# EAGLE design shift_reg (EAGLE 5.11)
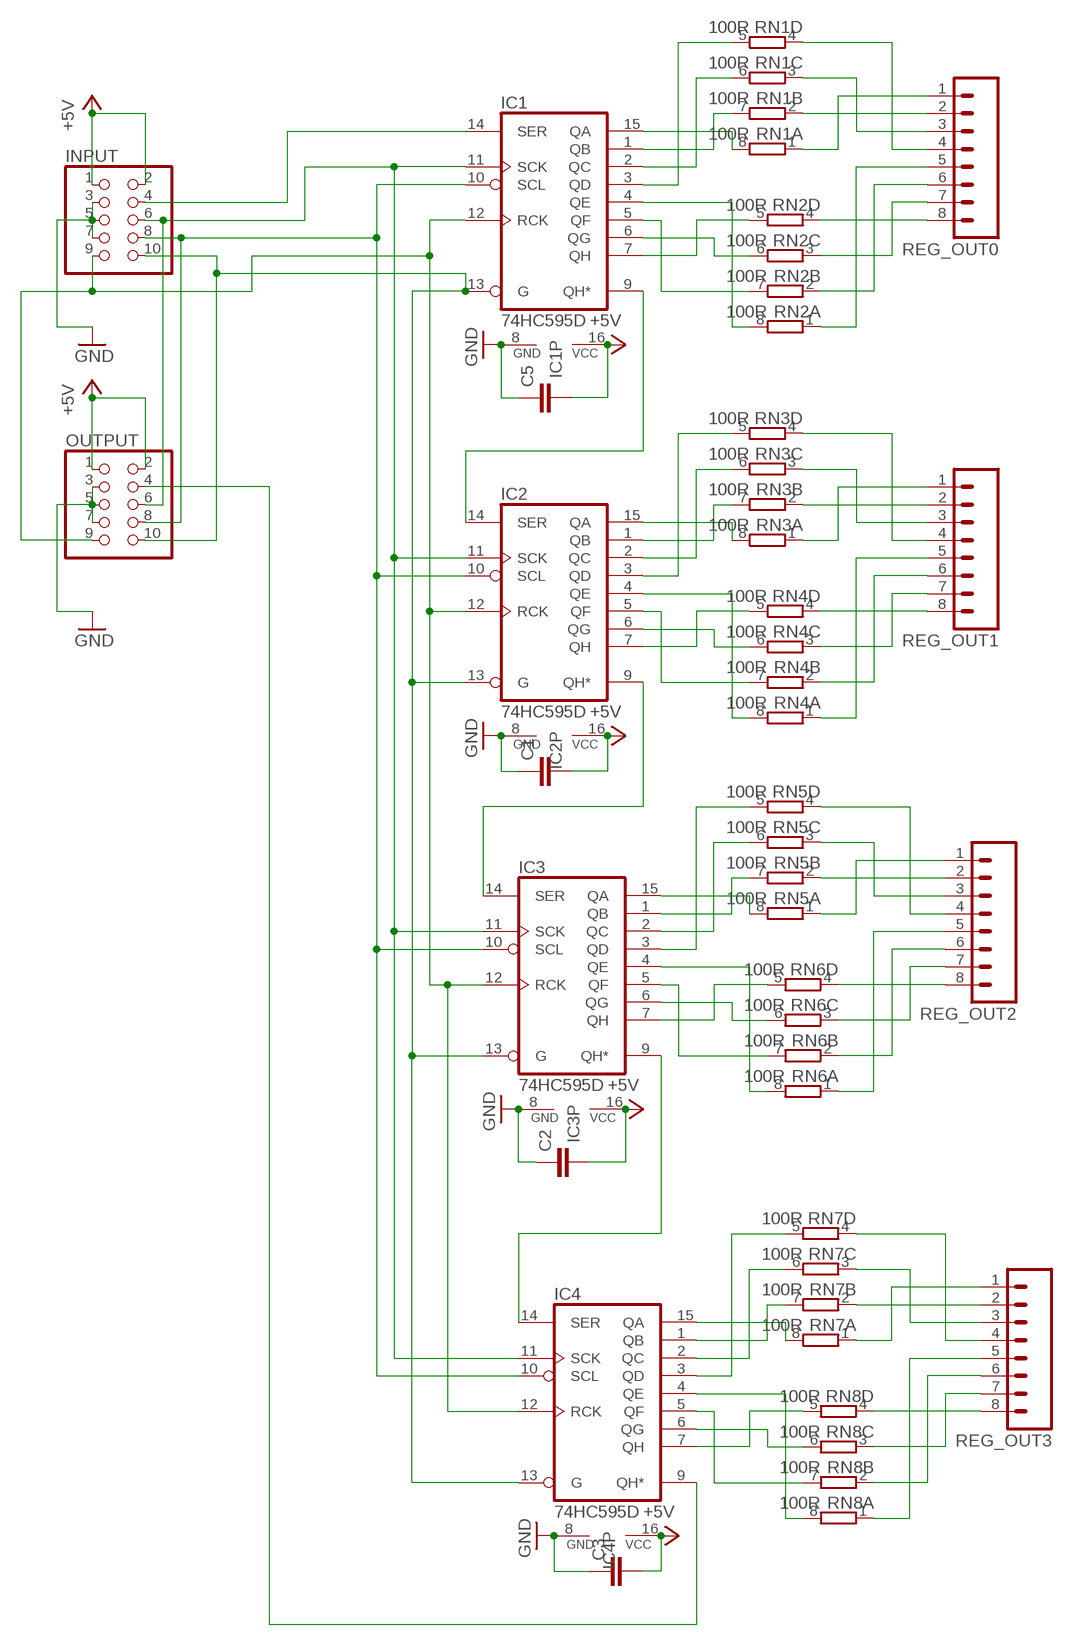
[diagram p0: schematic, sheet 1]

## Parts
C1  C-EUC0805K  [C0805K]
C2  C-EUC0805K  [C0805K]
C3  C-EUC0805K  [C0805K]
C5  C-EUC0805K  [C0805K]
IC1  74HC595D  [SO16]
IC2  74HC595D  [SO16]
IC3  74HC595D  [SO16]
IC4  74HC595D  [SO16]
INPUT  PINHD-2X5  [2X05]
OUTPUT  PINHD-2X5  [2X05]
REG_OUT0  M08  [1X08]
REG_OUT1  M08  [1X08]
REG_OUT2  M08  [1X08]
REG_OUT3  M08  [1X08]
RN1  100R  4R-NCAY16  [CAY16]
RN2  100R  4R-NCAY16  [CAY16]
RN3  100R  4R-NCAY16  [CAY16]
RN4  100R  4R-NCAY16  [CAY16]
RN5  100R  4R-NCAY16  [CAY16]
RN6  100R  4R-NCAY16  [CAY16]
RN7  100R  4R-NCAY16  [CAY16]
RN8  100R  4R-NCAY16  [CAY16]

## Nets
+5V [power]: C1.2 C2.2 C3.2 C5.2 IC1.16(VCC) IC2.16(VCC) IC3.16(VCC) IC4.16(VCC) INPUT.1 INPUT.2 OUTPUT.1 OUTPUT.2
CLOCK: IC1.11(SCK) IC2.11(SCK) IC3.11(SCK) IC4.11(SCK) INPUT.6 OUTPUT.6
GND [power]: C1.1 C2.1 C3.1 C5.1 IC1.8(GND) IC2.8(GND) IC3.8(GND) IC4.8(GND) INPUT.3 INPUT.5 INPUT.7 OUTPUT.3 OUTPUT.5 OUTPUT.7
LATCH: IC1.12(RCK) IC2.12(RCK) IC3.12(RCK) IC4.12(RCK) INPUT.9 OUTPUT.9
N$1: IC1.15(QA) RN1.8
N$2: IC1.1(QB) RN1.7
N$3: IC1.2(QC) RN1.6
N$4: IC1.3(QD) RN1.5
N$5: REG_OUT0.1 RN1.1
N$6: REG_OUT0.2 RN1.2
N$7: REG_OUT0.3 RN1.3
N$8: REG_OUT0.4 RN1.4
N$9: IC1.4(QE) RN2.8
N$10: IC1.5(QF) RN2.7
N$11: IC1.6(QG) RN2.6
N$12: IC1.7(QH) RN2.5
N$13: REG_OUT0.5 RN2.1
N$14: REG_OUT0.6 RN2.2
N$15: REG_OUT0.7 RN2.3
N$16: REG_OUT0.8 RN2.4
N$17: IC2.15(QA) RN3.8
N$18: IC2.1(QB) RN3.7
N$19: IC2.2(QC) RN3.6
N$20: IC2.3(QD) RN3.5
N$21: REG_OUT1.1 RN3.1
N$22: REG_OUT1.2 RN3.2
N$23: REG_OUT1.3 RN3.3
N$24: REG_OUT1.4 RN3.4
N$25: IC2.4(QE) RN4.8
N$26: IC2.5(QF) RN4.7
N$27: IC2.6(QG) RN4.6
N$28: IC2.7(QH) RN4.5
N$29: REG_OUT1.5 RN4.1
N$30: REG_OUT1.6 RN4.2
N$31: REG_OUT1.7 RN4.3
N$32: REG_OUT1.8 RN4.4
N$33: IC3.15(QA) RN5.8
N$34: IC3.1(QB) RN5.7
N$35: IC3.2(QC) RN5.6
N$36: IC3.3(QD) RN5.5
N$37: REG_OUT2.1 RN5.1
N$38: REG_OUT2.2 RN5.2
N$39: REG_OUT2.3 RN5.3
N$40: REG_OUT2.4 RN5.4
N$41: IC3.4(QE) RN6.8
N$42: IC3.5(QF) RN6.7
N$43: IC3.6(QG) RN6.6
N$44: IC3.7(QH) RN6.5
N$45: REG_OUT2.5 RN6.1
N$46: REG_OUT2.6 RN6.2
N$47: REG_OUT2.7 RN6.3
N$48: REG_OUT2.8 RN6.4
N$49: IC4.15(QA) RN7.8
N$50: IC4.1(QB) RN7.7
N$51: IC4.2(QC) RN7.6
N$52: IC4.3(QD) RN7.5
N$53: REG_OUT3.1 RN7.1
N$54: REG_OUT3.2 RN7.2
N$55: REG_OUT3.3 RN7.3
N$56: REG_OUT3.4 RN7.4
N$57: IC4.4(QE) RN8.8
N$58: IC4.5(QF) RN8.7
N$59: IC4.6(QG) RN8.6
N$60: IC4.7(QH) RN8.5
N$61: REG_OUT3.5 RN8.1
N$62: REG_OUT3.6 RN8.2
N$63: REG_OUT3.7 RN8.3
N$64: REG_OUT3.8 RN8.4
N$65: IC1.9(QH*) IC2.14(SER)
N$66: IC2.9(QH*) IC3.14(SER)
N$67: IC3.9(QH*) IC4.14(SER)
OE-: IC1.13(G) IC2.13(G) IC3.13(G) IC4.13(G) INPUT.10 OUTPUT.10
RESET-: IC1.10(SCL) IC2.10(SCL) IC3.10(SCL) IC4.10(SCL) INPUT.8 OUTPUT.8
SER_IN: IC1.14(SER) INPUT.4
SER_OUT: IC4.9(QH*) OUTPUT.4

## Library data of the parts
C1-C3 C5 = resistor:C-EU: CAPACITOR, European symbol
IC1-IC4 = 74xx-eu:74*595: 8-bit SHIFT REGISTER, output latch
INPUT OUTPUT = pinhead:PINHD-2X5: PIN HEADER
REG_OUT0 REG_OUT1-REG_OUT3 = SparkFun:M08: Header 8 Standard 8-pin 0.1" header. Use with straight break away headers (SKU : PRT-00116), right angle break away headers (PRT-00553), swiss pins (PRT-00743), machine pins (PRT-00117), and female headers (PRT-00115).
RN1-RN8 = resistor-dil:4R-N: Array Chip Resistor Source: RS Component / Phycomp; OC_FARNELL: unknown; OC_NEWARK: unknown

## Net classes
1 power: width 0.152 mm

## Board
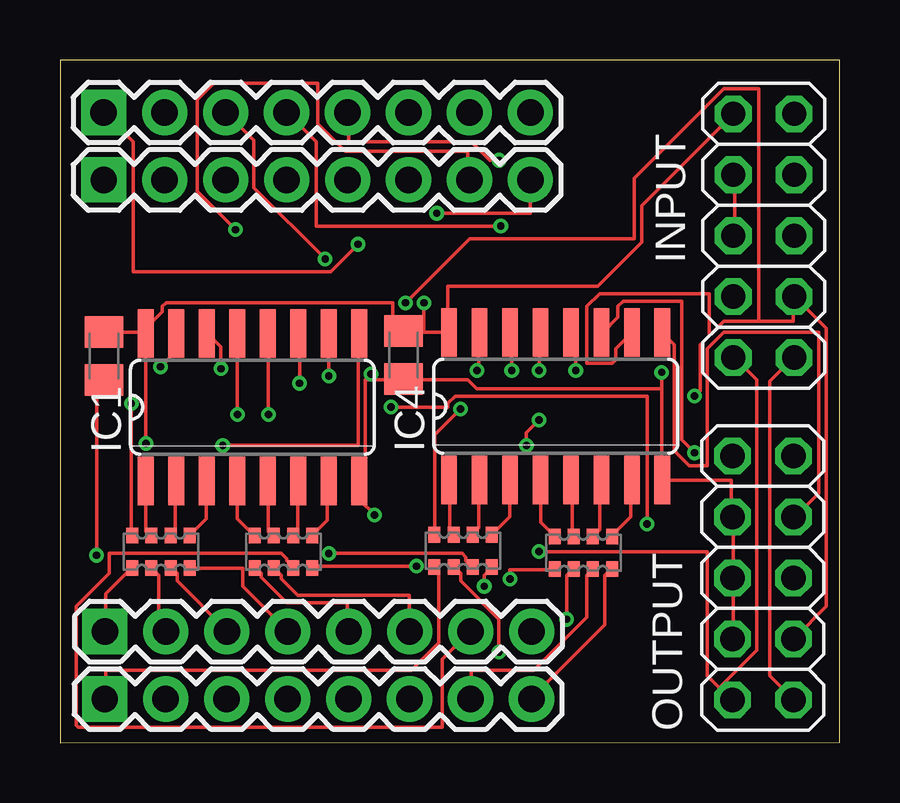
[diagram p1: board, top side]
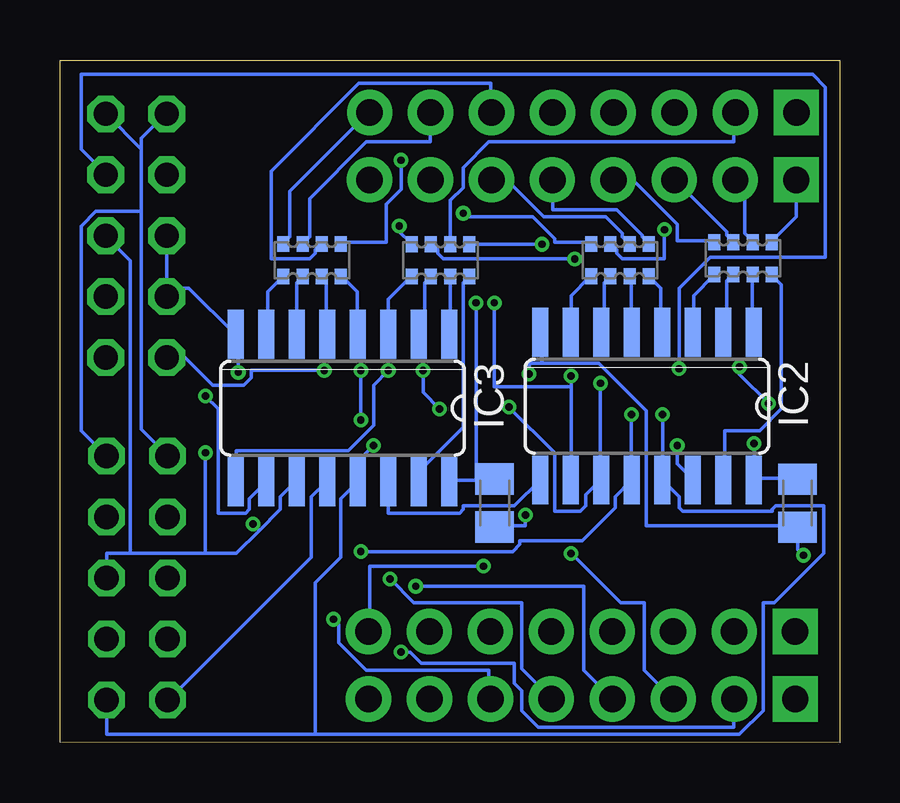
[diagram p2: board, bottom side, seen from below]

Size 32.5 x 28.46 mm. Coordinates in mm from the lower left corner, seen from the top.
Outline: 0,0 32.5,0.03 32.5,28.46 0,28.46 0,0
Copper layers (1*16): Top 0.035mm / dielectric 1.5mm / Bottom 0.035mm
Design rules "Fusion_eagle_rule_v1.1": minimum track width 6mil, minimum drill 12mil, track to track 6mil, track to pad 6mil, pad to pad 6mil, via to via 6mil, smd to smd 0mil, copper to edge 10mil, drill to drill 10mil, minimum pad ring 10mil, minimum via ring 6mil, stop-mask expansion 2mil, vias tented up to drill 100mil, thermal gap 10mil

### Footprints (pad centres in the part's own frame; a part is rotated, then mirrored left to right if it is on the bottom)
C0805K = smd 1.3 x 1.6: 1 -1,0; 2 1,0
SO16 = smd 0.66 x 2.032: 1 -4.445,-3.073; 2 -3.175,-3.073; 3 -1.905,-3.073; 4 -0.635,-3.073; 5 0.635,-3.073; 6 1.905,-3.073; 7 3.175,-3.073; 8 4.445,-3.073; 9 4.445,3.073; 10 3.175,3.073; 11 1.905,3.073; 12 0.635,3.073; 13 -0.635,3.073; 14 -1.905,3.073; 15 -3.175,3.073; 16 -4.445,3.073
2X05 = drill 1.016 octagon: 1 -5.08,-1.27; 2 -5.08,1.27; 3 -2.54,-1.27; 4 -2.54,1.27; 5 0,-1.27; 6 0,1.27; 7 2.54,-1.27; 8 2.54,1.27; 9 5.08,-1.27; 10 5.08,1.27
1X08 = drill 1.1 pad 1.88 square: 1 0,0 | drill 1.1 pad 1.88 round: 2 2.54,0; 3 5.08,0; 4 7.62,0; 5 10.16,0; 6 12.7,0; 7 15.24,0; 8 17.78,0
CAY16 = smd 0.5 x 0.65: 1 -1.2,-0.675; 2 -0.4,-0.675; 3 0.4,-0.675; 4 1.2,-0.675; 5 1.2,0.675; 6 0.4,0.675; 7 -0.4,0.675; 8 -1.2,0.675

### Placement (x,y rotation side)
C1  14.31,16.16 90 top
C2  1.84,16.13 90 top
C3  14.39,10 90 bottom
C5  1.77,9.99 90 bottom
IC1  8.02,13.99 0 top
IC2  8.04,14.04 180 bottom
IC3  20.73,13.95 180 bottom
IC4  20.66,14.03 0 top
INPUT  29.32,21.13 270 top
OUTPUT  29.29,6.88 270 top
REG_OUT0  1.87,4.64 0 top
REG_OUT1  1.82,23.46 0 top
REG_OUT2  1.82,26.27 0 top
REG_OUT3  1.86,1.83 0 top
RN1  4.21,7.97 0 top
RN2  9.31,7.97 0 top
RN3  4.04,20.19 180 bottom
RN4  9.17,20.12 180 bottom
RN5  16.64,20.11 180 bottom
RN6  21.99,20.12 180 bottom
RN7  16.8,8 0 top
RN8  21.81,7.92 0 top

### Tracks (layer width: path | path; a pad name or v marks a point on that pad's centre or on a via)
+5V  (via drill 0.3)
  Top 0.152: C2.2 1.91,17.12 3.51,17.12 IC1.16 | 15.16,17.12 16.15,17.12 IC4.16 16.15,17.2 16.15,19.02 22.4,19.02 24.23,20.85 24.23,22.38 28.04,26.19 INPUT.1 | 15.16,17.12 14.33,17.12 C1.2 14.25,17.2 13.87,17.58 13.87,18.34 4.42,18.34 4.27,18.19 4.27,17.96 3.51,17.2 IC1.16 | v3.58,12.47 3.58,17.04 IC1.16 | 15.16,17.12 v15.16,18.34
  Bottom 0.152: 29.11,24.74 29.11,25.2 28.12,26.19 INPUT.1 | 29.11,24.74 29.11,22.15 | 29.11,22.15 29.11,13.08 28.04,12.01 OUTPUT.1 | 29.11,22.15 31.01,22.15 31.62,21.54 31.62,13 30.63,12.01 OUTPUT.2 | 29.11,24.74 30.56,26.19 INPUT.2 | 15.16,10.95 16.23,10.95 IC3.16 | 15.16,10.95 14.4,10.95 C3.2 15.16,10.95 | C5.2 1.83,11.02 3.58,11.02 IC2.16 3.58,11.1 v3.58,12.47 | v15.16,18.34 15.16,10.95
CLOCK  (via drill 0.3)
  Top 0.152: v9.98,14.99 9.98,17.04 IC1.11 | v26.44,12.09 25.91,12.62 25.91,18.41 23.47,18.41 23.24,18.19 23.24,17.73 22.63,17.12 IC4.11 | v13.79,14 16.15,14 16.15,14.15 16.46,14.45 24.46,14.45 v24.46,9.12
  Bottom 0.152: v9.98,14.99 9.98,11.02 IC2.11 9.98,10.95 10.59,10.34 10.59,9.88 10.82,9.65 11.89,9.65 11.89,12.09 v13.79,14 | 24.19,8.85 25.15,7.9 26.44,7.9 | 24.19,8.85 23.32,9.73 23.32,10.26 22.71,10.87 IC3.11 | 29.57,7.9 30.56,7.9 30.56,6.91 OUTPUT.6 | 26.44,7.9 29.57,7.9 | 26.44,7.9 v26.44,12.09 | 29.57,7.9 29.57,20.09 30.56,21.08 INPUT.6 | v24.46,9.12 24.19,8.85
GND  (via drill 0.3)
  Top 0.152: v1.52,7.82 1.52,14.76 1.83,15.06 C2.1 | INPUT.3 28.12,23.67 28.12,21.16 INPUT.5 | v13.11,9.5 12.5,10.11 12.5,10.87 IC1.8 12.73,9.96 12.73,15.14 12.95,15.14 | 12.95,15.14 14.25,15.14 C1.1 14.33,15.14 16.99,15.14 17.37,14.76 25.07,14.76 | OUTPUT.7 28.04,4.39 28.04,6.83 OUTPUT.5 28.04,6.91 28.04,9.35 OUTPUT.3 27.97,9.42 27.97,10.95 25.15,10.95 IC4.8 25.07,11.02 25.07,14.76 | 25.07,14.76 v25.07,15.44 | v12.95,15.37 12.95,15.14
  Bottom 0.152: 12.42,15.82 10.06,15.82 8.08,13.84 8.08,9.04 1.83,9.04 C5.1 1.75,8.97 1.75,8.05 v1.52,7.82 | 12.42,15.82 12.42,17.04 IC2.8 | 28.04,18.95 27.13,18.95 25.22,17.04 IC3.8 25.15,16.97 25.07,16.89 v25.07,15.44 | 28.04,18.95 28.04,18.64 INPUT.7 28.04,18.95 | 28.04,18.95 28.04,21.08 INPUT.5 | v13.11,9.5 13.11,9.04 14.33,9.04 C3.1 | 12.42,15.82 12.95,15.82 v12.95,15.37
LATCH  (via drill 0.3)
  Top 0.152: v21.49,15.52 21.49,16.89 21.34,17.04 IC4.12 | v8.69,13.69 8.69,17.04 IC1.12 | v19.96,7.98 26.98,7.98 26.98,2.79 27.97,1.8 OUTPUT.9 27.51,2.34 29.03,3.86 29.03,15.14 28.12,16.05 INPUT.9
  Bottom 0.152: v21.49,15.52 24.54,15.52 24.54,15.21 24.84,14.91 26.14,14.91 27.28,16.05 INPUT.9 | v8.69,13.69 8.69,11.02 IC2.12 8.69,10.95 9.37,10.26 9.37,9.8 10.74,8.43 13.34,8.43 13.34,8.28 13.64,7.98 v19.96,7.98 | IC3.12 21.41,10.87 22.02,10.26 22.02,7.75 27.97,1.8 OUTPUT.9
N$1  (via drill 0.3)
  Top 0.152: v2.97,14.15 2.97,8.66 RN1.8 | v4.19,15.67 4.8,16.28 4.8,17.04 IC1.15
  Bottom 0.152: v2.97,14.15 4.19,15.37 v4.19,15.67
N$2
  Top 0.152: RN1.7 3.73,8.66 3.58,8.81 3.58,10.87 IC1.1
N$3
  Top 0.152: RN1.6 4.65,8.66 4.8,8.81 4.8,10.87 IC1.2
N$4
  Top 0.152: RN1.5 5.41,8.66 6.1,9.35 6.1,10.87 IC1.3
N$5
  Top 0.152: RN1.1 2.97,7.29 1.91,6.22 1.91,4.7 REG_OUT0.1
N$6
  Top 0.152: RN1.2 4.12,6.98 4.12,4.93 4.34,4.7 REG_OUT0.2
N$7
  Top 0.152: RN1.3 4.65,7.29 4.88,7.06 4.88,6.76 6.93,4.7 REG_OUT0.3
N$8
  Top 0.152: RN1.4 7.62,7.29 7.62,6.53 9.45,4.7 REG_OUT0.4
N$9
  Top 0.152: RN2.8 8.08,8.66 7.39,9.35 7.39,10.87 IC1.4
N$10
  Top 0.152: RN2.7 8.84,8.66 8.69,8.81 8.69,10.87 IC1.5
N$11
  Top 0.152: RN2.6 9.75,8.66 9.91,8.81 9.91,10.87 IC1.6
N$12
  Top 0.152: RN2.5 10.52,8.66 11.13,9.27 11.13,10.87 IC1.7
N$13
  Top 0.152: RN2.1 8.15,7.29 8.38,7.06 8.38,6.91 9.45,5.84 11.96,5.84 11.96,4.7 REG_OUT0.5
N$14
  Top 0.152: RN2.2 9.22,6.98 9.22,6.83 9.91,6.15 14.55,6.15 14.55,4.7 REG_OUT0.6
N$15
  Top 0.152: RN2.3 9.68,7.37 9.45,7.59 9.45,7.67 9.22,7.9 2.06,7.9 2.06,7.06 0.69,5.69 0.69,0.74 0.76,0.66 15.93,0.66 15.93,3.48 17.07,4.62 REG_OUT0.7
N$16  (via drill 0.3)
  Top 0.152: v14.86,7.37 10.52,7.37 RN2.4
  Bottom 0.152: v14.86,7.37 19.58,7.37 19.58,4.7 REG_OUT0.8
N$17
  Bottom 0.152: RN3.8 2.82,19.48 2.44,19.1 2.44,13.92 3.35,13 4.8,13 4.8,11.02 IC2.15
N$18
  Bottom 0.152: RN3.7 3.66,19.48 3.66,17.12 IC2.1
N$19
  Bottom 0.152: RN3.6 4.5,19.48 4.72,19.25 4.72,17.2 4.8,17.12 IC2.2
N$20
  Bottom 0.152: RN3.5 5.26,19.48 6.1,18.64 6.1,17.12 IC2.3
N$21
  Bottom 0.152: RN3.1 2.82,20.93 1.83,21.92 1.83,23.44 REG_OUT1.1
N$22
  Bottom 0.152: RN3.2 3.66,20.93 3.96,21.23 3.96,23.06 4.34,23.44 REG_OUT1.2
N$23
  Bottom 0.152: RN3.3 4.5,20.93 4.72,21.16 4.72,21.31 6.86,23.44 REG_OUT1.3
N$24
  Bottom 0.152: RN3.4 5.26,20.93 6.78,20.93 6.78,21.62 8.61,23.44 9.37,23.44 REG_OUT1.4
N$25
  Bottom 0.152: RN4.8 7.93,19.41 7.47,18.95 7.47,17.12 IC2.4
N$26
  Bottom 0.152: RN4.7 8.76,19.41 8.69,19.33 IC2.5
N$27
  Bottom 0.152: RN4.6 9.6,19.41 9.83,19.18 9.83,17.2 9.91,17.12 IC2.6
N$28
  Bottom 0.152: RN4.5 10.44,19.41 11.2,18.64 11.2,17.12 IC2.7
N$29
  Bottom 0.152: RN4.1 8,20.85 8.23,21.08 8.23,21.16 9.3,22.22 11.96,22.22 11.96,23.44 REG_OUT1.5
N$30
  Bottom 0.152: RN4.2 8.84,20.85 9.07,21.08 9.07,21.23 9.75,21.92 12.34,21.92 13.87,23.44 14.48,23.44 REG_OUT1.6
N$31  (via drill 0.3)
  Top 0.152: v7.32,21.39 5.72,22.99 5.72,26.8 6.4,27.48 10.74,27.48 10.74,25.81 11.89,24.66 16.99,24.66 16.99,23.52 REG_OUT1.7
  Bottom 0.152: v7.32,21.39 7.32,20.17 9.07,20.17 9.3,20.4 9.3,20.55 9.53,20.78 RN4.3
N$32  (via drill 0.3)
  Top 0.152: v15.7,22.07 19.58,22.07 19.58,23.44 REG_OUT1.8
  Bottom 0.152: v15.7,22.07 15.7,21.92 12.8,21.92 11.89,21.01 11.89,20.85 10.44,20.85 RN4.4
N$33
  Bottom 0.152: RN5.8 15.47,19.41 15.7,19.18 15.7,13.16 17.53,11.33 17.53,10.95 IC3.15
N$34
  Bottom 0.152: RN5.7 16.23,19.41 16.23,17.04 IC3.1
N$35
  Bottom 0.152: RN5.6 17.07,19.41 17.3,19.18 17.3,17.27 17.53,17.04 IC3.2
N$36
  Bottom 0.152: RN5.5 17.91,19.41 18.82,18.49 18.82,17.04 IC3.3
N$37  (via drill 0.3)
  Top 0.152: v12.42,20.78 11.28,19.63 3.05,19.63 3.05,25.04 REG_OUT2.1
  Bottom 0.152: v12.42,20.78 15.39,20.78 RN5.1
N$38
  Bottom 0.152: RN5.2 16.23,20.85 16.23,22.61 15.7,23.14 15.7,23.98 14.63,25.04 4.42,25.04 4.42,26.26 REG_OUT2.2
N$39  (via drill 0.3)
  Top 0.152: v11.05,20.17 8.08,23.14 8.08,25.12 6.93,26.26 REG_OUT2.3
  Bottom 0.152: v11.05,20.17 16.54,20.17 16.76,20.4 16.76,20.55 16.99,20.78 RN5.3
N$40  (via drill 0.3)
  Top 0.152: v18.36,21.54 10.67,21.54 10.67,25.04 REG_OUT2.4
  Bottom 0.152: v18.36,21.54 18.36,21.31 17.91,20.85 RN5.4
N$41
  Bottom 0.152: RN6.8 20.73,19.41 20.12,18.8 20.12,17.04 IC3.4
N$42
  Bottom 0.152: RN6.7 21.57,19.41 21.41,19.25 21.41,17.04 IC3.5
N$43
  Bottom 0.152: RN6.6 22.4,19.41 22.63,19.18 22.63,17.04 IC3.6
N$44
  Bottom 0.152: RN6.5 23.24,19.41 23.85,18.8 23.85,17.04 IC3.7
N$45  (via drill 0.3)
  Top 0.152: v18.29,24.28 17.91,24.28 17.15,25.04 12.04,25.04 12.04,26.26 REG_OUT2.5
  Bottom 0.152: v18.29,24.28 18.29,23.06 18.9,22.45 18.9,20.85 20.73,20.85 RN6.1
N$46
  Bottom 0.152: RN6.2 21.64,20.78 21.87,20.55 21.87,20.4 22.1,20.17 23.7,20.17 23.7,23.82 20.04,27.48 14.55,27.48 14.55,26.34 REG_OUT2.6
N$47
  Bottom 0.152: RN6.3 22.33,20.85 22.1,21.08 22.1,22.68 19.74,25.04 17.07,25.04 REG_OUT2.7
N$48
  Bottom 0.152: RN6.4 23.17,20.85 22.94,21.08 22.94,22.99 19.66,26.26 REG_OUT2.8
N$49  (via drill 0.3)
  Top 0.152: v16.69,13.92 15.62,12.85 15.62,8.74 RN7.8 | v17.37,15.52 17.45,15.6 17.45,17.04 IC4.15
  Bottom 0.152: v16.69,13.92 17.37,14.6 v17.37,15.52
N$50
  Top 0.152: RN7.7 16.38,8.74 16.23,8.89 16.23,10.95 IC4.1
N$51
  Top 0.152: RN7.6 17.22,8.74 17.45,8.97 17.45,10.95 IC4.2
N$52
  Top 0.152: RN7.5 18.06,8.74 18.75,9.42 IC4.3
N$53
  Top 0.152: RN7.1 15.62,7.29 15.77,7.14 15.77,4.17 14.63,3.02 1.91,3.02 1.91,1.88 REG_OUT3.1
N$54  (via drill 0.3)
  Top 0.152: v18.29,3.78 18.29,5.16 16.69,6.76 16.69,7.06 16.46,7.29 RN7.2
  Bottom 0.152: v18.29,3.78 17.91,3.78 17.45,3.33 13.56,3.33 13.56,2.49 13.26,2.18 13.26,1.35 12.57,0.66 4.42,0.66 4.42,1.8 REG_OUT3.2
N$55  (via drill 0.3)
  Top 0.152: v11.2,7.9 16.76,7.9 16.92,7.75 16.92,7.59 17.15,7.37 RN7.3
  Bottom 0.152: v11.2,7.9 9.14,5.84 8.15,5.84 8.15,3.02 7.01,1.88 REG_OUT3.3
N$56  (via drill 0.3)
  Top 0.152: v17.68,6.53 17.68,6.98 17.98,7.29 RN7.4
  Bottom 0.152: v17.68,6.53 10.67,6.53 10.67,3.02 9.53,1.88 REG_OUT3.4
N$57
  Top 0.152: RN8.8 20.57,8.66 20.04,9.19 20.04,10.95 IC4.4
N$58
  Top 0.152: RN8.7 21.34,8.66 21.34,10.95 IC4.5
N$59
  Top 0.152: RN8.6 22.25,8.66 22.48,8.89 22.48,10.87 IC4.6
N$60
  Top 0.152: RN8.5 23.01,8.66 23.77,9.42 23.77,10.95 IC4.7
N$61  (via drill 0.3)
  Top 0.152: v18.75,6.83 18.75,7.21 20.57,7.21 RN8.1
  Bottom 0.152: v18.75,6.83 17.76,5.84 13.26,5.84 13.26,3.1 12.04,1.88 REG_OUT3.5
N$62  (via drill 0.3)
  Top 0.152: v21.11,5.16 21.11,6.98 21.34,7.21 RN8.2
  Bottom 0.152: v21.11,5.16 20.88,4.93 20.88,4.17 19.74,3.02 14.63,3.02 14.63,1.88 REG_OUT3.6
N$63
  Top 0.152: RN8.3 22.17,7.21 21.95,6.98 21.95,5.23 19.74,3.02 17.15,3.02 17.15,1.88 REG_OUT3.7
N$64
  Top 0.152: RN8.4 22.94,7.21 22.71,6.98 22.71,4.93 19.66,1.88 REG_OUT3.8
N$65  (via drill 0.3)
  Top 0.152: v6.78,12.39 12.42,12.39 12.42,17.04 IC1.9
  Bottom 0.152: v6.78,12.39 6.78,11.63 6.17,11.02 IC2.14
N$66
  Bottom 0.152: IC2.9 12.5,10.95 13.56,9.88 15.7,9.88 15.7,9.73 15.85,9.58 18.82,9.58 IC3.14
N$67  (via drill 0.3)
  Top 0.152: v18.82,15.52 18.82,17.04 IC4.14
  Bottom 0.152: v18.82,15.52 19.43,14.91 19.43,13.23 20.5,12.17 25.15,12.17 25.15,10.95 IC3.9
OE-  (via drill 0.3)
  Top 0.152: v19.96,15.52 19.96,17.04 IC4.13 | v19.96,13.46 19.43,12.93 v19.43,12.39 | v7.39,13.69 7.39,17.04 IC1.13 | OUTPUT.10 29.57,2.79 29.57,15.06 30.56,16.05 INPUT.10
  Bottom 0.152: v19.96,13.46 v19.96,15.52 | v19.43,12.39 20.04,11.79 20.04,10.95 IC3.13 20.12,10.87 20.8,10.19 20.8,7.75 21.87,6.68 21.87,0.36 | v7.39,13.69 7.39,11.02 IC2.13 7.39,10.95 6.71,10.26 6.71,9.8 6.55,9.65 2.82,9.65 2.82,9.73 2.67,9.88 0.69,9.88 0.69,7.9 2.74,5.84 3.2,5.84 3.2,1.35 4.19,0.36 21.87,0.36 | 21.87,0.36 30.56,0.36 30.56,1.73 OUTPUT.10
RESET-  (via drill 0.3)
  Top 0.152: v11.2,15.29 11.2,17.04 IC1.10 | v26.44,14.45 26.67,14.68 26.67,16.59 27.09,17 | 27.09,17 27.66,17.58 29.11,17.58 | 29.11,17.58 30.56,17.58 30.56,18.57 INPUT.8 30.63,18.57 31.93,17.27 31.93,5.69 30.63,4.39 OUTPUT.8 | IC4.10 23.77,17.04 23.17,16.43 23.17,15.98 23.01,15.82 21.95,15.82 21.95,18.19 22.48,18.72 27.05,18.72 27.05,17.04 27.09,17 | v14.4,18.34 17.07,21.01 23.93,21.01 23.93,23.52 27.66,27.25 29.11,27.25 29.11,17.58
  Bottom 0.152: 11.2,14.83 v11.2,15.29 | 11.2,14.83 11.2,11.02 IC2.10 | v26.44,14.45 25.91,13.92 25.91,9.58 24.77,9.58 24.61,9.73 24.61,10.19 23.93,10.87 IC3.10 | 11.2,14.83 14.4,14.83 v14.4,18.34
SER_IN  (via drill 0.3)
  Top 0.152: v6.71,15.6 6.71,16.51 6.17,17.04 IC1.14
  Bottom 0.152: v6.71,15.6 6.71,18.95 5.41,20.24 0.61,20.24 0.61,27.33 1.14,27.86 31.62,27.86 31.62,24.74 30.63,23.75 INPUT.4
SER_OUT
  Top 0.152: IC4.9 25.15,17.04 25.6,16.59 25.6,12.17 26.21,11.56 26.98,11.56 26.98,16.43 27.66,17.12 31.62,17.12 31.62,10.41 30.63,9.42 OUTPUT.4